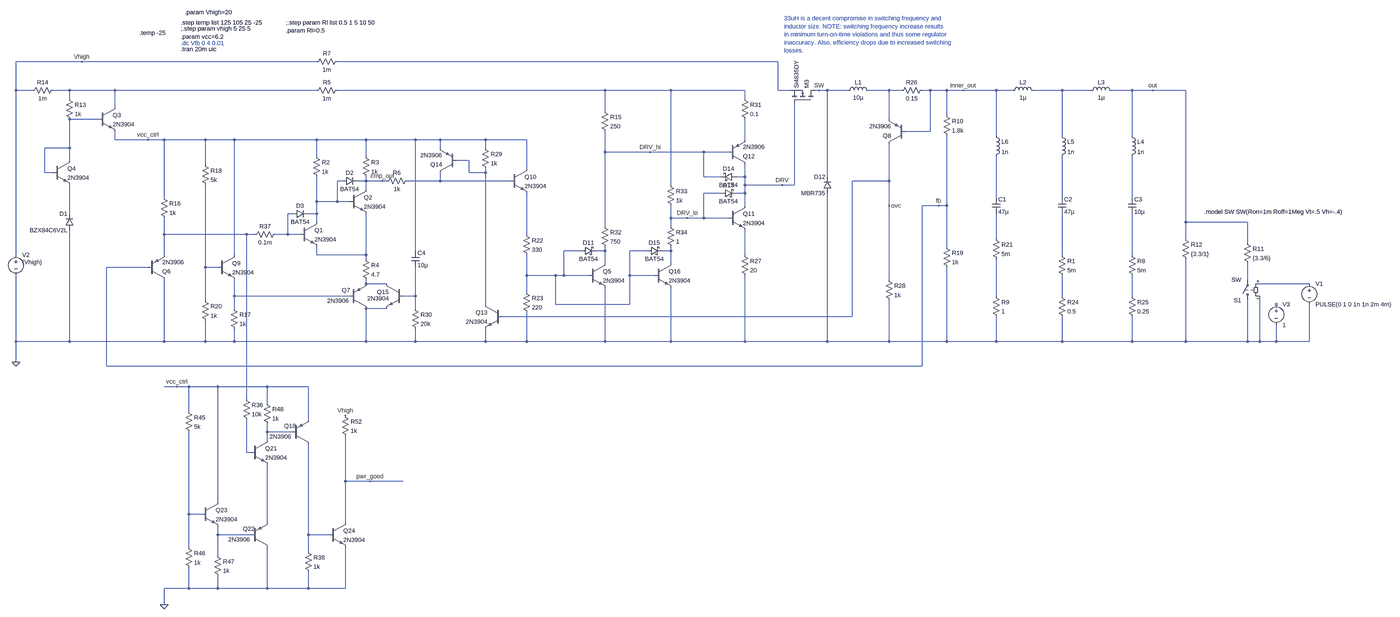
[diagram p0: schematic hyst_voltage_regulator4.asc, whole sheet]
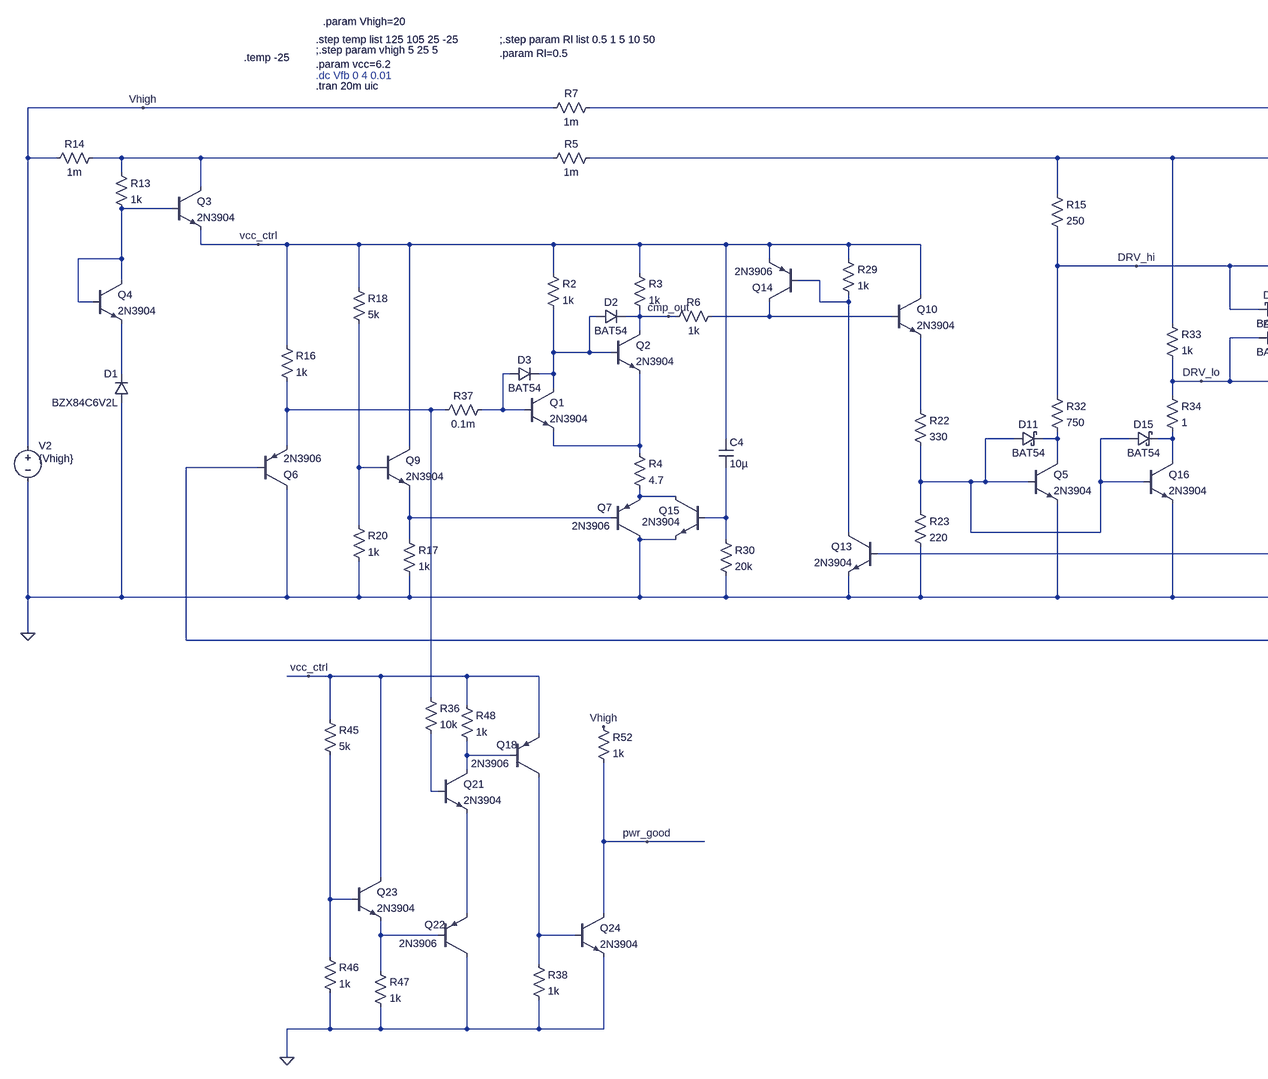
[diagram p1: schematic hyst_voltage_regulator4.asc, part, row 1 of 1, column 1 of 2]
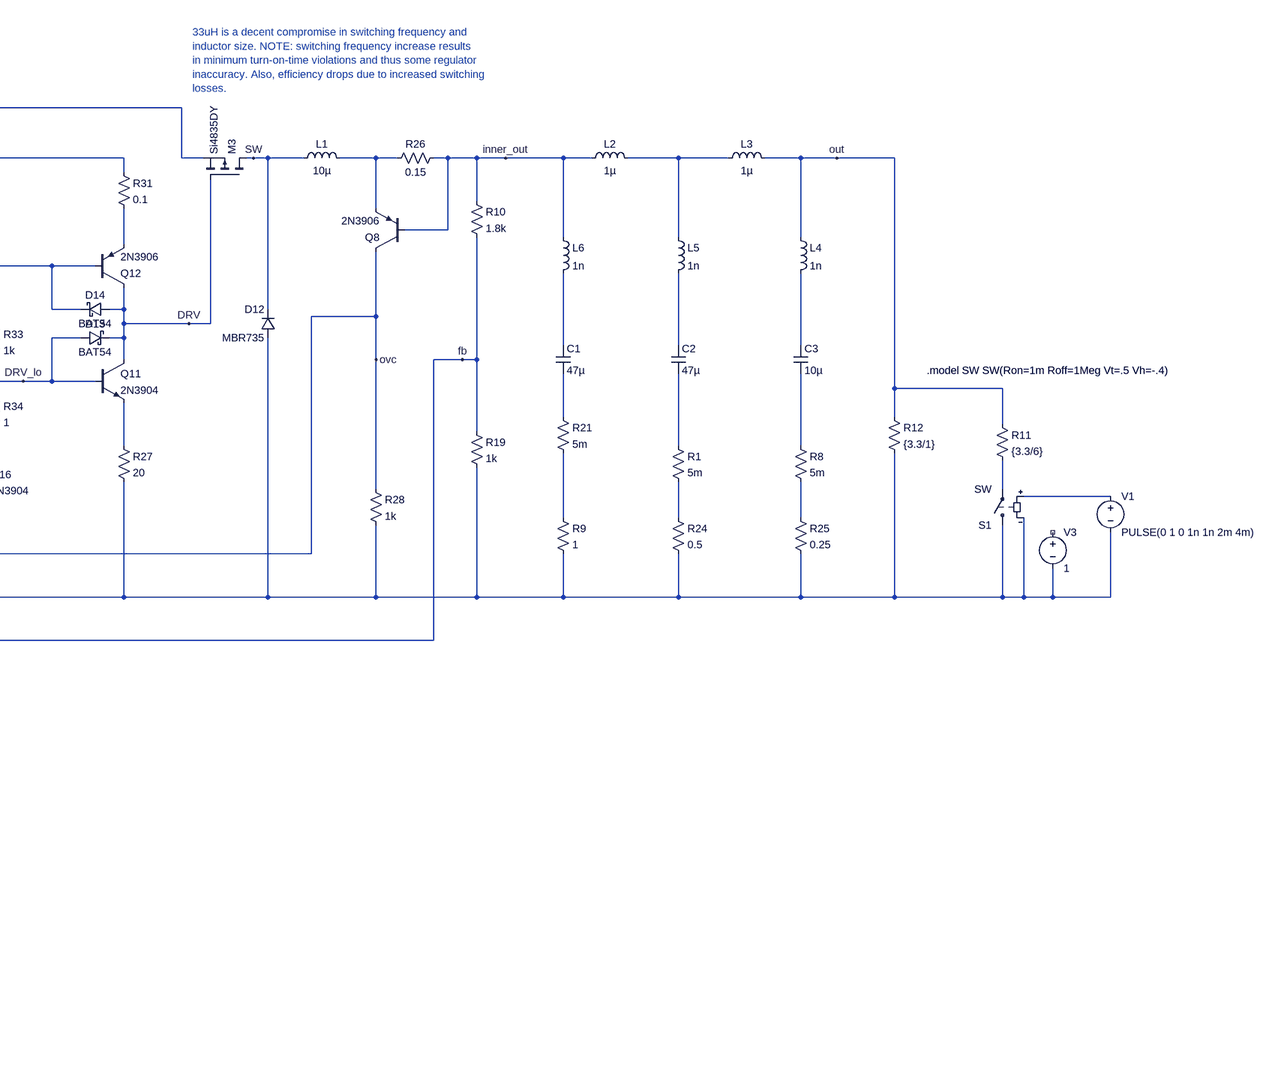
[diagram p2: schematic hyst_voltage_regulator4.asc, part, row 1 of 1, column 2 of 2]
hyst_voltage_regulator4.asc, the LTspice schematic file:
Version 4.1
SHEET 1 5252 3804
WIRE -704 -544 -960 -544
WIRE 208 -544 -704 -544
WIRE 2000 -544 288 -544
WIRE -960 -432 -960 -544
WIRE -896 -432 -960 -432
WIRE -752 -432 -816 -432
WIRE -576 -432 -752 -432
WIRE 208 -432 -576 -432
WIRE 1328 -432 288 -432
WIRE 1584 -432 1328 -432
WIRE 1872 -432 1584 -432
WIRE 2000 -432 2000 -544
WIRE 2048 -432 2000 -432
WIRE 2160 -432 2144 -432
WIRE 2192 -432 2160 -432
WIRE 2272 -432 2192 -432
WIRE 2432 -432 2352 -432
WIRE 2480 -432 2432 -432
WIRE 2592 -432 2560 -432
WIRE 2656 -432 2592 -432
WIRE 2720 -432 2656 -432
WIRE 2848 -432 2720 -432
WIRE 2912 -432 2848 -432
WIRE 3104 -432 2992 -432
WIRE 3216 -432 3104 -432
WIRE 3376 -432 3296 -432
WIRE 3456 -432 3376 -432
WIRE 3584 -432 3456 -432
WIRE -752 -400 -752 -432
WIRE 1872 -400 1872 -432
WIRE -576 -368 -576 -432
WIRE 1328 -352 1328 -432
WIRE 2656 -336 2656 -432
WIRE -640 -320 -752 -320
WIRE 2432 -320 2432 -432
WIRE 2592 -272 2592 -432
WIRE 2592 -272 2496 -272
WIRE 2848 -256 2848 -432
WIRE 3104 -256 3104 -432
WIRE 3376 -256 3376 -432
WIRE -576 -240 -576 -272
WIRE -448 -240 -576 -240
WIRE -384 -240 -448 -240
WIRE -224 -240 -384 -240
WIRE -112 -240 -224 -240
WIRE 208 -240 -112 -240
WIRE 400 -240 208 -240
WIRE 592 -240 400 -240
WIRE 688 -240 592 -240
WIRE 864 -240 688 -240
WIRE 1024 -240 864 -240
WIRE 1872 -240 1872 -320
WIRE -752 -208 -752 -320
WIRE -752 -208 -848 -208
WIRE 688 -208 688 -240
WIRE 864 -208 864 -240
WIRE 1328 -192 1328 -272
WIRE 1504 -192 1328 -192
WIRE 1712 -192 1504 -192
WIRE 1808 -192 1712 -192
WIRE 208 -176 208 -240
WIRE 400 -176 400 -240
WIRE -752 -160 -752 -208
WIRE 800 -160 752 -160
WIRE -224 -144 -224 -240
WIRE 1024 -128 1024 -240
WIRE -848 -112 -848 -208
WIRE -816 -112 -848 -112
WIRE 800 -112 800 -160
WIRE 864 -112 864 -128
WIRE 864 -112 800 -112
WIRE 1712 -96 1712 -192
WIRE 1776 -96 1712 -96
WIRE 1872 -96 1872 -144
WIRE 1872 -96 1840 -96
WIRE 2192 -96 2192 -432
WIRE 304 -80 288 -80
WIRE 400 -80 400 -96
WIRE 400 -80 368 -80
WIRE 464 -80 400 -80
WIRE 480 -80 464 -80
WIRE 688 -80 688 -112
WIRE 688 -80 560 -80
WIRE 960 -80 688 -80
WIRE 2432 -80 2432 -224
WIRE 2432 -80 2288 -80
WIRE 1584 -64 1584 -432
WIRE 1872 -64 1872 -96
WIRE 2016 -64 1872 -64
WIRE 2064 -64 2064 -384
WIRE 2064 -64 2016 -64
WIRE 400 -48 400 -80
WIRE 1776 -32 1712 -32
WIRE 1872 -32 1872 -64
WIRE 1872 -32 1840 -32
WIRE -384 -16 -384 -240
WIRE 2848 -16 2848 -176
WIRE 3104 -16 3104 -176
WIRE 3376 -16 3376 -176
WIRE 208 0 208 -96
WIRE 288 0 288 -80
WIRE 288 0 208 0
WIRE 336 0 288 0
WIRE 1872 16 1872 -32
WIRE 2432 16 2432 -80
WIRE 2624 16 2560 16
WIRE 2656 16 2656 -256
WIRE 2656 16 2624 16
WIRE -752 48 -752 -64
WIRE 112 48 96 48
WIRE 208 48 208 0
WIRE 208 48 176 48
WIRE 1584 64 1584 16
WIRE 1648 64 1584 64
WIRE 1712 64 1712 -32
WIRE 1712 64 1648 64
WIRE 1808 64 1712 64
WIRE 208 80 208 48
WIRE 3584 80 3584 -432
WIRE 3824 80 3584 80
WIRE 1328 96 1328 -192
WIRE 1584 96 1584 64
WIRE -384 128 -384 64
WIRE -64 128 -384 128
WIRE -32 128 -64 128
WIRE 96 128 96 48
WIRE 96 128 48 128
WIRE 144 128 96 128
WIRE 1024 128 1024 -32
WIRE 2848 144 2848 48
WIRE 3584 144 3584 80
WIRE 3824 160 3824 80
WIRE 2656 176 2656 16
WIRE 592 192 592 -240
WIRE 1232 192 1168 192
WIRE 1328 192 1328 176
WIRE 1328 192 1296 192
WIRE 1488 192 1424 192
WIRE 1584 192 1584 176
WIRE 1584 192 1552 192
WIRE -960 208 -960 -432
WIRE -384 208 -384 128
WIRE -112 208 -112 -240
WIRE 208 208 208 176
WIRE 400 208 400 48
WIRE 400 208 208 208
WIRE 1872 208 1872 112
WIRE 3104 208 3104 48
WIRE 3376 208 3376 48
WIRE 400 224 400 208
WIRE 1328 240 1328 192
WIRE 1584 240 1584 192
WIRE -448 256 -608 256
WIRE -224 256 -224 -64
WIRE -176 256 -224 256
WIRE 1024 288 1024 208
WIRE 1136 288 1024 288
WIRE 1168 288 1168 192
WIRE 1168 288 1136 288
WIRE 1264 288 1168 288
WIRE 1424 288 1424 192
WIRE 1520 288 1424 288
WIRE 2432 304 2432 16
WIRE 3824 304 3824 240
WIRE 400 320 400 304
WIRE 480 320 400 320
WIRE 4064 320 3872 320
WIRE 1024 352 1024 288
WIRE -112 368 -112 304
WIRE 336 368 -112 368
WIRE 592 368 592 256
WIRE 592 368 544 368
WIRE 2848 368 2848 224
WIRE 3104 368 3104 288
WIRE 3376 368 3376 288
WIRE -224 384 -224 256
WIRE 864 400 864 -112
WIRE 1136 400 1136 288
WIRE 1424 400 1424 288
WIRE 1424 400 1136 400
WIRE -112 416 -112 368
WIRE 480 416 400 416
WIRE 592 416 592 368
WIRE 2288 448 2288 -80
WIRE 2288 448 928 448
WIRE -960 544 -960 288
WIRE -752 544 -752 112
WIRE -752 544 -960 544
WIRE -384 544 -384 304
WIRE -384 544 -752 544
WIRE -224 544 -224 464
WIRE -224 544 -384 544
WIRE -112 544 -112 496
WIRE -112 544 -224 544
WIRE 400 544 400 416
WIRE 400 544 -112 544
WIRE 592 544 592 496
WIRE 592 544 400 544
WIRE 864 544 864 496
WIRE 864 544 592 544
WIRE 1024 544 1024 432
WIRE 1024 544 864 544
WIRE 1328 544 1328 336
WIRE 1328 544 1024 544
WIRE 1584 544 1584 336
WIRE 1584 544 1328 544
WIRE 1872 544 1872 288
WIRE 1872 544 1584 544
WIRE 2192 544 2192 -32
WIRE 2192 544 1872 544
WIRE 2432 544 2432 384
WIRE 2432 544 2192 544
WIRE 2656 544 2656 256
WIRE 2656 544 2432 544
WIRE 2848 544 2848 448
WIRE 2848 544 2656 544
WIRE 3104 544 3104 448
WIRE 3104 544 2848 544
WIRE 3376 544 3376 448
WIRE 3376 544 3104 544
WIRE 3584 544 3584 224
WIRE 3584 544 3376 544
WIRE 3824 544 3824 384
WIRE 3824 544 3584 544
WIRE 3872 544 3872 368
WIRE 3872 544 3824 544
WIRE 3936 544 3936 480
WIRE 3936 544 3872 544
WIRE 4064 544 4064 400
WIRE 4064 544 3936 544
WIRE -960 624 -960 544
WIRE -608 640 -608 256
WIRE 2560 640 2560 16
WIRE 2560 640 -608 640
WIRE -336 720 -384 720
WIRE -288 720 -336 720
WIRE -176 720 -288 720
WIRE 16 720 -176 720
WIRE 176 720 16 720
WIRE -64 768 -64 128
WIRE 16 784 16 720
WIRE -288 816 -288 720
WIRE 176 848 176 720
WIRE 16 896 16 864
WIRE 112 896 16 896
WIRE 16 928 16 896
WIRE -64 976 -64 848
WIRE -48 976 -64 976
WIRE 320 1088 320 912
WIRE 416 1088 320 1088
WIRE 544 1088 416 1088
WIRE -176 1168 -176 720
WIRE -288 1216 -288 896
WIRE -240 1216 -288 1216
WIRE 16 1248 16 1024
WIRE 320 1248 320 1088
WIRE -176 1296 -176 1264
WIRE -48 1296 -176 1296
WIRE 176 1296 176 944
WIRE 256 1296 176 1296
WIRE -288 1344 -288 1216
WIRE 176 1360 176 1296
WIRE -176 1376 -176 1296
WIRE -288 1504 -288 1424
WIRE -288 1504 -384 1504
WIRE -176 1504 -176 1456
WIRE -176 1504 -288 1504
WIRE 16 1504 16 1344
WIRE 16 1504 -176 1504
WIRE 176 1504 176 1440
WIRE 176 1504 16 1504
WIRE 320 1504 320 1344
WIRE 320 1504 176 1504
WIRE -384 1568 -384 1504
FLAG -960 624 0
FLAG 2720 -432 inner_out
FLAG 2624 16 fb
FLAG 3456 -432 out
FLAG 1504 -192 DRV_hi
FLAG 2016 -64 DRV
FLAG 2160 -432 SW
FLAG 1648 64 DRV_lo
FLAG -704 -544 Vhigh
FLAG 464 -80 cmp_out
FLAG 2432 16 ovc
FLAG -448 -240 vcc_ctrl
FLAG -384 1568 0
FLAG -336 720 vcc_ctrl
FLAG 416 1088 pwr_good
FLAG 320 832 Vhigh
SYMBOL npn 144 80 R0
SYMATTR InstName Q1
SYMATTR Value 2N3904
SYMBOL npn 336 -48 R0
SYMATTR InstName Q2
SYMATTR Value 2N3904
SYMBOL res 192 -192 R0
SYMATTR InstName R2
SYMATTR Value 1k
SYMBOL res 384 -192 R0
SYMATTR InstName R3
SYMATTR Value 1k
SYMBOL res 384 208 R0
SYMATTR InstName R4
SYMATTR Value 4.7
SYMBOL voltage -960 192 R0
WINDOW 3 24 44 Left 2
WINDOW 123 0 0 Left 0
WINDOW 39 0 0 Left 0
SYMATTR Value {Vhigh}
SYMATTR InstName V2
SYMBOL res 576 -96 R90
WINDOW 0 0 56 VBottom 2
WINDOW 3 32 56 VTop 2
SYMATTR InstName R6
SYMATTR Value 1k
SYMBOL diode 304 -64 R270
WINDOW 0 32 32 VTop 2
WINDOW 3 0 32 VBottom 2
SYMATTR InstName D2
SYMATTR Value BAT54
SYMBOL diode 112 64 R270
WINDOW 0 32 32 VTop 2
WINDOW 3 0 32 VBottom 2
SYMATTR InstName D3
SYMATTR Value BAT54
SYMBOL ind 2256 -416 R270
WINDOW 0 32 56 VTop 2
WINDOW 3 4 56 VBottom 2
SYMATTR InstName L1
SYMATTR Value 10µ
SYMATTR SpiceLine Rser=1m
SYMBOL res 3808 144 R0
SYMATTR InstName R11
SYMATTR Value {3.3/6}
SYMBOL res 2640 -352 R0
SYMATTR InstName R10
SYMATTR Value 1.8k
SYMBOL res 2640 160 R0
SYMATTR InstName R19
SYMATTR Value 1k
SYMBOL ind 3200 -416 R270
WINDOW 0 32 56 VTop 2
WINDOW 3 4 56 VBottom 2
SYMATTR InstName L3
SYMATTR Value 1µ
SYMATTR SpiceLine Rser=1m
SYMBOL cap 3360 -16 R0
SYMATTR InstName C3
SYMATTR Value 10µ
SYMBOL res 3360 192 R0
SYMATTR InstName R8
SYMATTR Value 5m
SYMBOL npn 1264 240 R0
SYMATTR InstName Q5
SYMATTR Value 2N3904
SYMBOL schottky 1232 208 R270
WINDOW 0 32 32 VTop 2
WINDOW 3 0 32 VBottom 2
SYMATTR InstName D11
SYMATTR Value BAT54
SYMATTR Description Diode
SYMATTR Type diode
SYMBOL npn 960 -128 R0
SYMATTR InstName Q10
SYMATTR Value 2N3904
SYMBOL res 1312 -368 R0
SYMATTR InstName R15
SYMATTR Value 250
SYMBOL res 1008 112 R0
SYMATTR InstName R22
SYMATTR Value 330
SYMBOL res 1008 336 R0
SYMATTR InstName R23
SYMATTR Value 220
SYMBOL npn 1808 16 R0
SYMATTR InstName Q11
SYMATTR Value 2N3904
SYMBOL pnp 1808 -144 M180
SYMATTR InstName Q12
SYMATTR Value 2N3906
SYMBOL diode 2208 -32 R180
WINDOW 0 24 64 Left 2
WINDOW 3 24 0 Left 2
SYMATTR InstName D12
SYMATTR Value MBR735
SYMBOL schottky 1776 -16 R270
WINDOW 0 32 32 VTop 2
WINDOW 3 0 32 VBottom 2
SYMATTR InstName D13
SYMATTR Value BAT54
SYMATTR Description Diode
SYMATTR Type diode
SYMBOL schottky 1840 -80 M270
WINDOW 0 32 32 VTop 2
WINDOW 3 0 32 VBottom 2
SYMATTR InstName D14
SYMATTR Value BAT54
SYMATTR Description Diode
SYMATTR Type diode
SYMBOL res 1856 192 R0
SYMATTR InstName R27
SYMATTR Value 20
SYMBOL pmos 2144 -384 M270
SYMATTR InstName M3
SYMATTR Value Si4835DY
SYMBOL res 1856 -416 R0
SYMATTR InstName R31
SYMATTR Value 0.1
SYMBOL res 1312 80 R0
SYMATTR InstName R32
SYMATTR Value 750
SYMBOL npn 1520 240 R0
SYMATTR InstName Q16
SYMATTR Value 2N3904
SYMBOL schottky 1488 208 R270
WINDOW 0 32 32 VTop 2
WINDOW 3 0 32 VBottom 2
SYMATTR InstName D15
SYMATTR Value BAT54
SYMATTR Description Diode
SYMATTR Type diode
SYMBOL res 1568 -80 R0
SYMATTR InstName R33
SYMATTR Value 1k
SYMBOL res 1568 80 R0
SYMATTR InstName R34
SYMATTR Value 1
SYMBOL res 304 -448 R90
WINDOW 0 0 56 VBottom 2
WINDOW 3 32 56 VTop 2
SYMATTR InstName R5
SYMATTR Value 1m
SYMBOL res 304 -560 R90
WINDOW 0 0 56 VBottom 2
WINDOW 3 32 56 VTop 2
SYMATTR InstName R7
SYMATTR Value 1m
SYMBOL sw 3824 400 R180
SYMATTR InstName S1
SYMBOL res 3568 128 R0
SYMATTR InstName R12
SYMATTR Value {3.3/1}
SYMBOL voltage 4064 304 R0
WINDOW 123 0 0 Left 0
WINDOW 39 0 0 Left 0
SYMATTR InstName V1
SYMATTR Value PULSE(0 1 0 1n 1n 2m 4m)
SYMBOL cap 2832 -16 R0
SYMATTR InstName C1
SYMATTR Value 47µ
SYMBOL res 2832 352 R0
SYMATTR InstName R9
SYMATTR Value 1
SYMBOL diode -736 112 R180
WINDOW 0 24 64 Left 2
WINDOW 3 24 0 Left 2
SYMATTR InstName D1
SYMATTR Value BZX84C6V2L
SYMBOL res -768 -416 R0
SYMATTR InstName R13
SYMATTR Value 1k
SYMBOL npn -640 -368 R0
SYMATTR InstName Q3
SYMATTR Value 2N3904
SYMBOL npn -816 -160 R0
SYMATTR InstName Q4
SYMATTR Value 2N3904
SYMBOL res -800 -448 R90
WINDOW 0 0 56 VBottom 2
WINDOW 3 32 56 VTop 2
SYMATTR InstName R14
SYMATTR Value 1m
SYMBOL pnp -448 304 M180
SYMATTR InstName Q6
SYMATTR Value 2N3906
SYMBOL res -400 -32 R0
SYMATTR InstName R16
SYMATTR Value 1k
SYMBOL res -240 -160 R0
SYMATTR InstName R18
SYMATTR Value 5k
SYMBOL res -240 368 R0
SYMATTR InstName R20
SYMATTR Value 1k
SYMBOL pnp 336 416 M180
WINDOW 0 -30 71 Left 2
WINDOW 3 -87 30 Left 2
SYMATTR InstName Q7
SYMATTR Value 2N3906
SYMBOL npn -176 208 R0
SYMATTR InstName Q9
SYMATTR Value 2N3904
SYMBOL res -128 400 R0
SYMATTR InstName R17
SYMATTR Value 1k
SYMBOL ind 2896 -416 R270
WINDOW 0 32 56 VTop 2
WINDOW 3 4 56 VBottom 2
SYMATTR InstName L2
SYMATTR Value 1µ
SYMATTR SpiceLine Rser=1m
SYMBOL cap 3088 -16 R0
SYMATTR InstName C2
SYMATTR Value 47µ
SYMBOL res 3088 192 R0
SYMATTR InstName R1
SYMATTR Value 5m
SYMBOL voltage 3936 384 R0
SYMATTR InstName V3
SYMATTR Value 1
SYMBOL ind 3360 -272 R0
SYMATTR InstName L4
SYMATTR Value 1n
SYMBOL ind 3088 -272 R0
SYMATTR InstName L5
SYMATTR Value 1n
SYMBOL ind 2832 -272 R0
SYMATTR InstName L6
SYMATTR Value 1n
SYMBOL res 2832 128 R0
SYMATTR InstName R21
SYMATTR Value 5m
SYMBOL res 3088 352 R0
SYMATTR InstName R24
SYMATTR Value 0.5
SYMBOL res 3360 352 R0
SYMATTR InstName R25
SYMATTR Value 0.25
SYMBOL res 2464 -416 R270
WINDOW 0 32 56 VTop 2
WINDOW 3 0 56 VBottom 2
SYMATTR InstName R26
SYMATTR Value 0.15
SYMBOL pnp 2496 -224 R180
SYMATTR InstName Q8
SYMATTR Value 2N3906
SYMBOL res 2416 288 R0
SYMATTR InstName R28
SYMATTR Value 1k
SYMBOL npn 928 400 M0
SYMATTR InstName Q13
SYMATTR Value 2N3904
SYMBOL res 848 -224 R0
SYMATTR InstName R29
SYMATTR Value 1k
SYMBOL pnp 752 -112 R180
SYMATTR InstName Q14
SYMATTR Value 2N3906
SYMBOL cap 576 192 R0
SYMATTR InstName C4
SYMATTR Value 10µ
SYMBOL npn 544 320 M0
WINDOW 3 54 57 Left 2
SYMATTR Value 2N3904
SYMATTR InstName Q15
SYMBOL res 576 400 R0
SYMATTR InstName R30
SYMATTR Value 20k
SYMBOL npn -48 928 R0
SYMATTR InstName Q21
SYMATTR Value 2N3904
SYMBOL pnp -48 1344 M180
WINDOW 0 -30 71 Left 2
WINDOW 3 -87 30 Left 2
SYMATTR InstName Q22
SYMATTR Value 2N3906
SYMBOL res -304 800 R0
SYMATTR InstName R45
SYMATTR Value 5k
SYMBOL res -304 1328 R0
SYMATTR InstName R46
SYMATTR Value 1k
SYMBOL npn -240 1168 R0
SYMATTR InstName Q23
SYMATTR Value 2N3904
SYMBOL res -192 1360 R0
SYMATTR InstName R47
SYMATTR Value 1k
SYMBOL res 0 768 R0
SYMATTR InstName R48
SYMATTR Value 1k
SYMBOL npn 256 1248 R0
SYMATTR InstName Q24
SYMATTR Value 2N3904
SYMBOL res 304 816 R0
SYMATTR InstName R52
SYMATTR Value 1k
SYMBOL res -80 752 R0
SYMATTR InstName R36
SYMATTR Value 10k
SYMBOL res 64 112 R90
WINDOW 0 0 56 VBottom 2
WINDOW 3 32 56 VTop 2
SYMATTR InstName R37
SYMATTR Value 0.1m
SYMBOL pnp 112 944 M180
WINDOW 0 -30 71 Left 2
WINDOW 3 -87 30 Left 2
SYMATTR InstName Q18
SYMATTR Value 2N3906
SYMBOL res 160 1344 R0
SYMATTR InstName R38
SYMATTR Value 1k
TEXT -320 -616 Left 2 ;.dc Vfb 0 4 0.01
TEXT -320 -672 Left 2 !;.step param vhigh 5 25 5\n.param vcc=6.2
TEXT -320 -696 Left 2 !.step temp list 125 105 25 -25
TEXT -320 -592 Left 2 !.tran 20m uic
TEXT 2024 -712 Left 2 ;33uH is a decent compromise in switching frequency and\ninductor size. NOTE: switching frequency increase results\nin minimum turn-on-time violations and thus some regulator\ninaccuracy. Also, efficiency drops due to increased switching\nlosses.
TEXT -304 -736 Left 2 !.param Vhigh=20
TEXT 88 -696 Left 2 !;.step param Rl list 0.5 1 5 10 50\n.param Rl=0.5
TEXT 3656 40 Left 2 !.model SW SW(Ron=1m Roff=1Meg Vt=.5 Vh=-.4)
TEXT -480 -656 Left 2 !.temp -25

The netlist it stands for:
* hyst_voltage_regulator4.asc
Q1 N009 N015 N022 0 2N3904
Q2 cmp_out N009 N022 0 2N3904
R2 vcc_ctrl N009 1k
R3 vcc_ctrl cmp_out 1k
R4 N022 N028 4.7
V2 Vhigh 0 {Vhigh}
R6 N010 cmp_out 1k
D2 N009 cmp_out BAT54
D3 N015 N009 BAT54
L1 SW N004 10µ Rser=1m
R11 out N027 {3.3/6}
R10 inner_out fb 1.8k
R19 fb 0 1k
L3 N005 out 1µ Rser=1m
C3 N013 N025 10µ
R8 N025 N034 5m
Q5 N020 N019 0 0 2N3904
D11 N019 N020 BAT54
Q10 vcc_ctrl N010 N017 0 2N3904
R15 N003 DRV_hi 250
R22 N017 N019 330
R23 N019 0 220
Q11 DRV DRV_lo N023 0 2N3904
Q12 DRV DRV_hi N007 0 2N3906
D12 0 SW MBR735
D13 DRV_lo DRV BAT54
D14 DRV DRV_hi BAT54
R27 N023 0 20
M3 SW DRV N001 N001 Si4835DY
R31 N003 N007 0.1
R32 DRV_hi N020 750
Q16 N021 N019 0 0 2N3904
D15 N019 N021 BAT54
R33 N003 DRV_lo 1k
R34 DRV_lo N021 1
R5 N003 N002 1m
R7 N001 Vhigh 1m
S1 0 N027 N029 0 SW
R12 out 0 {3.3/1}
V1 N029 0 PULSE(0 1 0 1n 1n 2m 4m)
C1 N011 N018 47µ
R9 N032 0 1
D1 0 N014 BZX84C6V2L
R13 N002 N006 1k
Q3 N002 N006 vcc_ctrl 0 2N3904
Q4 N006 N006 N014 0 2N3904
R14 N002 Vhigh 1m
Q6 0 fb N016 0 2N3906
R16 vcc_ctrl N016 1k
R18 vcc_ctrl N026 5k
R20 N026 0 1k
Q7 0 N030 N028 0 2N3906
Q9 vcc_ctrl N026 N030 0 2N3904
R17 N030 0 1k
L2 inner_out N005 1µ Rser=1m
C2 N012 N024 47µ
R1 N024 N033 5m
V3 NC_01 0 1
L4 out N013 1n
L5 N005 N012 1n
L6 inner_out N011 1n
R21 N018 N032 5m
R24 N033 0 0.5
R25 N034 0 0.25
R26 N004 inner_out 0.15
Q8 ovc inner_out N004 0 2N3906
R28 ovc 0 1k
Q13 N008 ovc 0 0 2N3904
R29 vcc_ctrl N008 1k
Q14 N010 N008 vcc_ctrl 0 2N3906
C4 vcc_ctrl N031 10µ
Q15 N028 N031 0 0 2N3904
R30 N031 0 20k
Q21 N035 N036 N038 0 2N3904
Q22 0 N039 N038 0 2N3906
R45 vcc_ctrl N037 5k
R46 N037 0 1k
Q23 vcc_ctrl N037 N039 0 2N3904
R47 N039 0 1k
R48 vcc_ctrl N035 1k
Q24 pwr_good N040 0 0 2N3904
R52 Vhigh pwr_good 1k
R36 N016 N036 10k
R37 N015 N016 0.1m
Q18 N040 N035 vcc_ctrl 0 2N3906
R38 N040 0 1k
.model D D
.lib standard.dio
.model NPN NPN
.model PNP PNP
.lib standard.bjt
.model NMOS NMOS
.model PMOS PMOS
.lib standard.mos
* .dc Vfb 0 4 0.01
;.step param vhigh 5 25 5
.param vcc=6.2
.step temp list 125 105 25 -25
.tran 20m uic
* 33uH is a decent compromise in switching frequency and
* inductor size. NOTE: switching frequency increase results
* in minimum turn-on-time violations and thus some regulator
* inaccuracy. Also, efficiency drops due to increased switching
* losses.
.param Vhigh=20
;.step param Rl list 0.5 1 5 10 50
.param Rl=0.5
.model SW SW(Ron=1m Roff=1Meg Vt=.5 Vh=-.4)
.temp -25
.backanno
.end